# EAGLE design MEMS-preamp_v13b_VBAT (EAGLE 8.5.0)

## Sheet 1 of 2
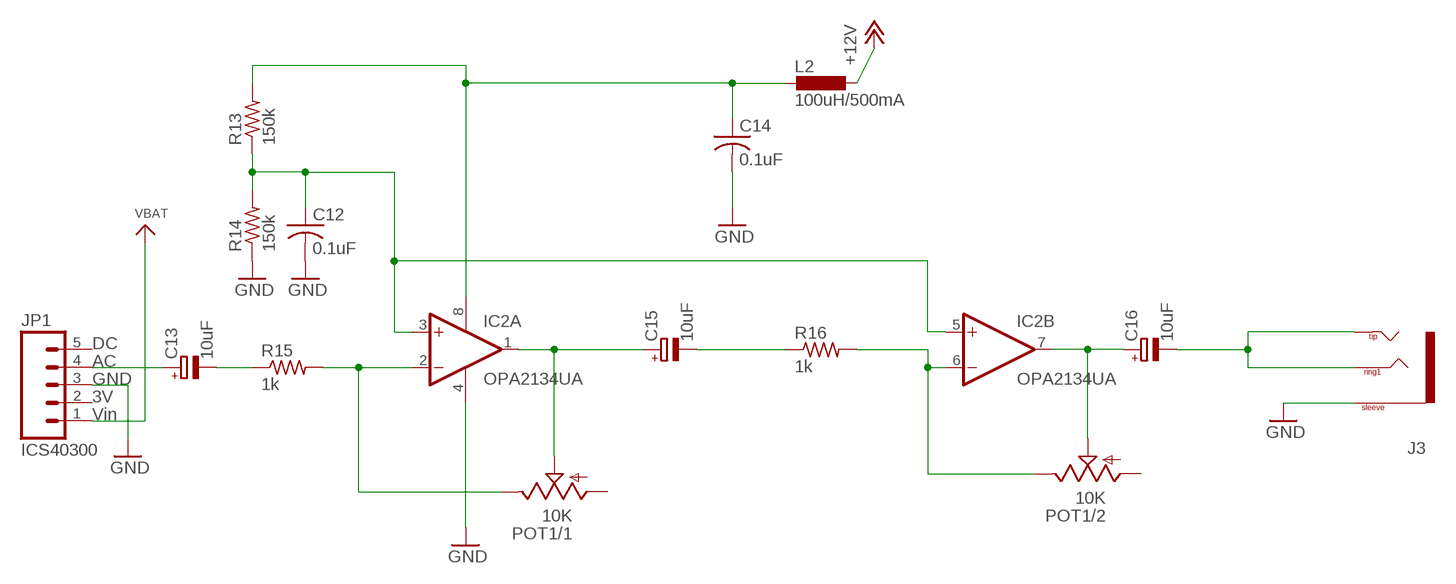
[diagram p0: schematic, sheet 1]

### Parts
C12  0.1uF  C-USC0805  [C0805]
C13  10uF  CPOL-EUB  [PANASONIC_B]
C14  0.1uF  C-USC0805K  [C0805K]
C15  10uF  CPOL-EUB  [PANASONIC_B]
C16  10uF  CPOL-EUB  [PANASONIC_B]
IC2  OPA2134UA  [SO08]
J3  TRS-1/8"-3.5MM  [TRS_SJ-3524-SMT]
JP1  ICS40300  M05SMD_2.54MM  [1X05_SMD_STRAIGHT]
L2  100uH/500mA  L-EUL3225M  [L3225M]
POT1  10K  POT-DUAL-PTV112-4420  [PTV112]
R13  150k  R-US_R0603  [R0603]
R14  150k  R-US_R0603  [R0603]
R15  1k  R-US_R0603  [R0603]
R16  1k  R-US_R0603  [R0603]

### Nets
+12V: L2.1 ; also sheet 2
GND: C12.2 C14.2 IC2.4(A:V-) J3.1(SLEEVE) JP1.3 R14.1 ; also sheet 2
N$3: C13.+ JP1.4
N$4: C15.- R16.1
N$5: IC2.2(A:-IN) POT1.1.3(/1:E) R15.2
N$7: C16.- J3.2(TIP) J3.3(RING1) J3.4(TIP)
N$8: C12.1 IC2.3(A:+IN) IC2.5(B:+IN) R13.1 R14.2
N$9: C15.+ IC2.1(A:OUT) POT1.1.2(/1:S)
N$10: C16.+ IC2.7(B:OUT) POT1.2.2(/2:S)
N$15: C14.1 IC2.8(A:V+) L2.2 R13.2
N$21: IC2.6(B:-IN) POT1.2.3(/2:E) R16.2
N$23: C13.- R15.1
VBAT: JP1.1 ; also sheet 2
Unconnected: JP1.2 JP1.5 POT1.1.1(/1:A) POT1.2.1(/2:A)

## Sheet 2 of 2
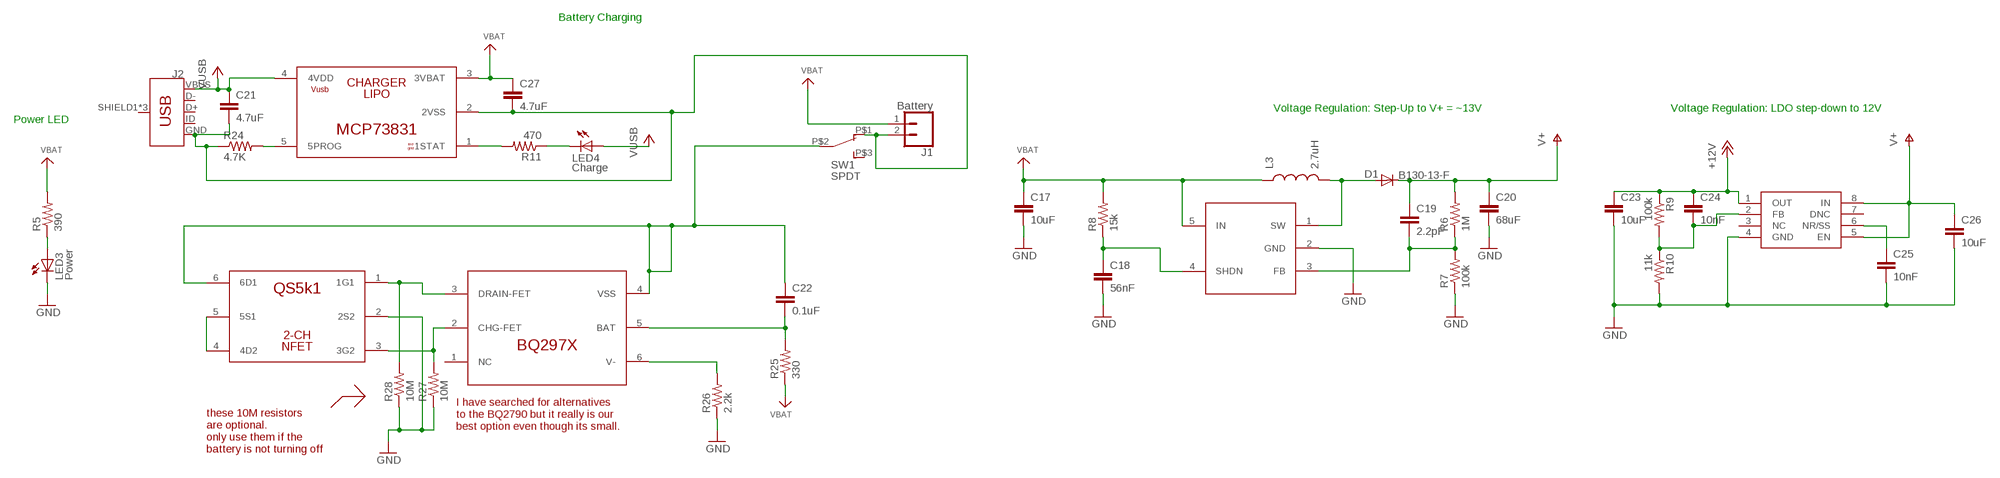
[diagram p1: schematic, sheet 2]

### Parts
C17  10uF  C-EUC0603  [C0603]
C18  56nF  C-EUC0603  [C0603]
C19  2.2pF  C-EUC0603  [C0603]
C20  68uF  C-EUC1206  [C1206]
C21  4.7uF  C-EUC0603  [C0603]
C22  0.1uF  C-EUC0603  [C0603]
C23  10uF  C-EUC0603  [C0603]
C24  10nF  C-EUC0603  [C0603]
C25  10nF  C-EUC0603  [C0603]
C26  10uF  C-EUC0603  [C0603]
C27  4.7uF  C-EUC0603  [C0603]
D1  B130-13-F  DIODESMA  [SMA-DIODE]
IC7  TPS7A49  [MSOP-8]
IC8  BQ297X  BQ297X-BATTERY-MANAGERLONG  [WSON-6-LONG]
IC9  SC4503  [SOT23-5]
IC10  MCP73831  [SOT-23-5]
IC11  QS6K1  [SOT457R_PHILIPS]
J1  Battery  CONN_02LOCK  [1X02_LOCK]
J2  USB_MICRO-BREDUCED_PASTE  [USB-B-MICRO-SMD_RED_PASTE]
L3  2.7uH  INDUCTORCR54  [CR54]
LED3  Power  LED3MM  [LED3MM]
LED4  Charge  LED3MM  [LED3MM]
R5  390  R-US_R0603  [R0603]
R6  1M  R-US_R0603  [R0603]
R7  100k  R-US_R0603  [R0603]
R8  15k  R-US_R0603  [R0603]
R9  100k  R-US_R0603  [R0603]
R10  11k  R-US_R0603  [R0603]
R11  470  R-US_R0603  [R0603]
R24  4.7K  R-US_R0603  [R0603]
R25  330  R-US_R0603  [R0603]
R26  2.2k  R-US_R0603  [R0603]
R27  10M  R-US_R0603  [R0603]
R28  10M  R-US_R0603  [R0603]
SW1  SPDT  SWITCH_SPDTCL-SB-12B  [SWITCH_SPDT_CL-SB-12B]

### Nets
+5V: C21.1 IC10.4(4VDD) J2.VBUS LED4.A ; supply symbol labelled VUSB
+12V: C23.1 C24.1 IC7.1(OUT) R9.1 ; also sheet 1
BATGND1: C22.1 IC8.4(VSS) IC11.6(6D1) SW1.P$2
GND: C17.2 C18.2 C20.2 C23.2 C25.2 C26.2 IC7.4(GND) IC9.2(GND) IC11.2(2S2) LED3.K(C) R7.1 R10.2 R26.1 R27.1 R28.1 ; also sheet 1
N$6: LED3.A R5.1
N$11: D1.A IC9.1(SW) L3.P$2
N$12: C18.1 IC9.4(SHDN) R8.1
N$13: C19.2 IC9.3(FB) R6.1 R7.2
N$14: C24.2 IC7.2(FB) R9.2 R10.1
N$16: C25.1 IC7.6(NR/SS)
N$17: LED4.K(C) R11.1
N$19: C22.2 IC8.5(BAT) R25.2
N$20: IC10.5(5PROG) R24.2
N$24: IC10.1(1STAT) R11.2
N$33: IC11.4(4D2) IC11.5(5S1)
N$35: IC8.3(DRAIN-FET) IC11.1(1G1) R28.2
N$36: IC8.2(CHG-FET) IC11.3(3G2) R27.2
N$37: IC8.6(V-) R26.2
USBGND1: C21.2 C27.2 IC10.2(2VSS) J1.2 J2.GND R24.1 SW1.P$1
V+: C19.1 C20.1 C26.1 D1.C IC7.5(EN) IC7.8(IN) R6.2
VBAT: C17.1 C27.1 IC9.5(IN) IC10.3(3VBAT) J1.1 L3.P$1 R5.2 R8.2 R25.1 ; also sheet 1
Unconnected: IC7.3(NC) IC7.7(DNC) IC8.1(NC) J2.D+ J2.D- J2.ID J2.SHIELD1(SHIELD) J2.SHIELD2(SHIELD) J2.SHIELD3(SHIELD) SW1.P$3

### Notes on the sheet
- Battery Charging
- Voltage Regulation: Step-Up to V+ = ~13V | Voltage Regulation: LDO step-down to 12V
- Power LED
- I have searched for alternatives 
  to the BQ2790 but it really is our 
  best option even though its small.
- these 10M resistors
  are optional. 
  only use them if the 
  battery is not turning off

## Library data of the parts
C12 C14 = adafruit:C-US: CAPACITOR, American symbol
C13 C15 C16 = CMU-ArtFab:CPOL-EU: POLARIZED CAPACITOR, European symbol
C17-C27 = rcl:C-EU: CAPACITOR, European symbol; SPICEPREFIX: C
D1 = SparkFun:DIODE: Diode These are standard reverse protection diodes and small signal diodes. SMA package can handle up to about 1A. SOD-323 can handle about 200mA. What the SOD-323 package when ordering, there are some mfgs out there that are 5-pin packages.
IC2 = linear:OPA2*: Dual Operational Amplifier Low Power, Single-Supply, Rail-To-Rail Operational Amplifier Source: http://focus.ti.com/lit/ds/symlink/opa2345.pdf http://focus.ti.com .. opa241.pdf http://focus.ti.com/lit/ds/symlink/opa2134.pdf
IC7 = CMU-ArtFab:TPS7A49
IC8 = CMU-ArtFab:BQ297X-BATTERY-MANAGER
IC9 = CMU-ArtFab:SC4503
IC10 = CMU-ArtFab:MCP73831
IC11 = CMU-ArtFab:QS6K1
J1 = SparkFun-Connectors:CONN_02: Multi connection point. Often used as Generic Header-pin footprint for 0.1 inch spaced/style header connections On any of the 0.1 inch spaced packages, you can populate with these: Break Away Headers - Straight <https://www.sparkfun.com/products/116> (PRT-00116) Break Away Male Headers - Right Angle <https://www.sparkfun.com/products/553> (PRT-00553) Female Headers <https://www.sparkfun.com/products/115> (PRT-00115) Break Away Headers - Machine Pin <https://www.sparkfun.com/products/117> (PRT-00117) Break Away Female Headers - Swiss Machine Pin <https://www.sparkfun.com/products/743> (PRT-00743) For SCREWTERMINALS and SPRING TERMINALS visit here: Screw Terimnals on SparkFun.com <https://www.sparkfun.com/search/results?term=Screw+Terminals> (5mm/3.5mm/2.54mm spacing) This device is also useful as a general connection point to wire up your design to another part of your project. Our various solder wires solder well into these plated through hole pads. Hook-Up Wire - Assortment (Stranded, 22 AWG) <https://www.sparkfun.com/products/11375> (PRT-11375) Hook-Up Wire - Assortment (Solid Core, 22 AWG) <https://www.sparkfun.com/products/11367> (PRT-11367) View the entire wire category on our website here <https://www.sparkfun.com/categories/141> Special notes: Molex polarized connector foot print use with: PRT-08233 with associated crimp pins and housings. 2.54_SCREWTERM for use with PRT-10571. 3.5mm Screw Terminal footprints for PRT-08084 5mm Screw Terminal footprints for use with PRT-08432
J2 = CMU-ArtFab:USB_MICRO-B: USB Type Micro-B Connector Male/female and PTH/SMT variants SparkFun Products: SparkFun microB USB Breakout <https://www.sparkfun.com/products/12035> SparkFun USB microB Plug Breakout <https://www.sparkfun.com/products/10031> SparkFun ESP8266 Thing <https://www.sparkfun.com/products/13231>; PROD_ID: CONN-11752
J3 = CMU-ArtFab:TRS-1/8"-3.5MM
JP1 = CMU-ArtFab:M05: Multi connection point. Often used as Generic Header-pin footprint for 0.1 inch spaced/style header connections On any of the 0.1 inch spaced packages, you can populate with these: Break Away Headers - Straight <https://www.sparkfun.com/products/116> (PRT-00116) Break Away Male Headers - Right Angle <https://www.sparkfun.com/products/553> (PRT-00553) Female Headers <https://www.sparkfun.com/products/115> (PRT-00115) Break Away Headers - Machine Pin <https://www.sparkfun.com/products/117> (PRT-00117) Break Away Female Headers - Swiss Machine Pin <https://www.sparkfun.com/products/743> (PRT-00743) For SCREWTERMINALS and SPRING TERMINALS visit here: Screw Terimnals on SparkFun.com <https://www.sparkfun.com/search/results?term=Screw+Terminals> (5mm/3.5mm/2.54mm spacing) This device is also useful as a general connection point to wire up your design to another part of your project. Our various solder wires solder well into these plated through hole pads. Hook-Up Wire - Assortment (Stranded, 22 AWG) <https://www.sparkfun.com/products/11375> (PRT-11375) Hook-Up Wire - Assortment (Solid Core, 22 AWG) <https://www.sparkfun.com/products/11367> (PRT-11367) View the entire wire category on our website here <https://www.sparkfun.com/categories/141> Special notes: Molex polarized connector foot print use with SKU : PRT-08231 with associated crimp pins and housings. 1MM SMD Version SKU: PRT-10208; CON1: Vin; CON2: 3V; CON3: GND; CON4: AC; CON5: DC
L2 = rcl:L-EU: INDUCTOR, European symbol; SPICEPREFIX: L
L3 = SparkFun-Passives:INDUCTOR: Inductors Basic Inductor/Choke - 0603 and 1206. Footprints are not proven and vary greatly between part numbers. SRN6045- 33uH, 20% 1.4A SDR0403-560KL - 56uH, 10%, 500mA RMS/740mA peak
LED3 LED4 = led:LED: LED OSRAM: - CHIPLED LG R971, LG N971, LY N971, LG Q971, LY Q971, LO R971, LY R971 LH N974, LH R974 LS Q976, LO Q976, LY Q976 LO Q996 - Hyper CHIPLED LW Q18S LB Q993, LB Q99A, LB R99A - SideLED LS A670, LO A670, LY A670, LG A670, LP A670 LB A673, LV A673, LT A673, LW A673 LH A674 LY A675 LS A676, LA A676, LO A676, LY A676, LW A676 LS A679, LY A679, LG A679 - Hyper Micro SIDELED® LS Y876, LA Y876, LO Y876, LY Y876 LT Y87S - SmartLED LW L88C, LW L88S LB L89C, LB L89S, LG L890 LS L89K, LO L89K, LY L89K LS L896, LA L896, LO L896, LY L896 - TOPLED LS T670, LO T670, LY T670, LG T670, LP T670 LSG T670, LSP T670, LSY T670, LOP T670, LYG T670 LG T671, LOG T671, LSG T671 LB T673, LV T673, LT T673, LW T673 LH T674 LS T676, LA T676, LO T676, LY T676, LB T676, LH T676, LSB T676, LW T676 LB T67C, LV T67C, LT T67C, LS T67K, LO T67K, LY T67K, LW E67C LS E67B, LA E67B, LO E67B, LY E67B, LB E67C, LV E67C, LT E67C LW T67C LS T679, LY T679, LG T679 LS T770, LO T770, LY T770, LG T770, LP T770 LB T773, LV T773, LT T773, LW T773 LH T774 LS E675, LA E675, LY E675, LS T675 LS T776, LA T776, LO T776, LY T776, LB T776 LHGB T686 LT T68C, LB T68C - Hyper Mini TOPLED® LB M676 - Mini TOPLED Santana® LG M470 LS M47K, LO M47K, LY M47K Source: http://www.osram.convergy.de LUXEON: - LUMILED® LXK2-PW12-R00, LXK2-PW12-S00, LXK2-PW14-U00, LXK2-PW14-V00 LXK2-PM12-R00, LXK2-PM12-S00, LXK2-PM14-U00 LXK2-PE12-Q00, LXK2-PE12-R00, LXK2-PE12-S00, LXK2-PE14-T00, LXK2-PE14-U00 LXK2-PB12-K00, LXK2-PB12-L00, LXK2-PB12-M00, LXK2-PB14-N00, LXK2-PB14-P00, LXK2-PB14-Q00 LXK2-PR12-L00, LXK2-PR12-M00, LXK2-PR14-Q00, LXK2-PR14-R00 LXK2-PD12-Q00, LXK2-PD12-R00, LXK2-PD12-S00 LXK2-PH12-R00, LXK2-PH12-S00 LXK2-PL12-P00, LXK2-PL12-Q00, LXK2-PL12-R00 Source: www.luxeon.com KINGBRIGHT: KA-3528ASYC Source: www.kingbright.com
POT1 = CMU-ArtFab:POT-DUAL-PTV112: Bourns 11mm dual potentiometer; AVAILABILITY: Unavailable; DESCRIPTION: Alt# Tce-10111410; MF: STMicroelectronics; MP: PTV112; PACKAGE: None; PRICE: None
R5-R11 R13-R16 R24-R28 = CMU-ArtFab:R-US_: RESISTOR, American symbol
SW1 = CMU-ArtFab:SWITCH_SPDT

## Board
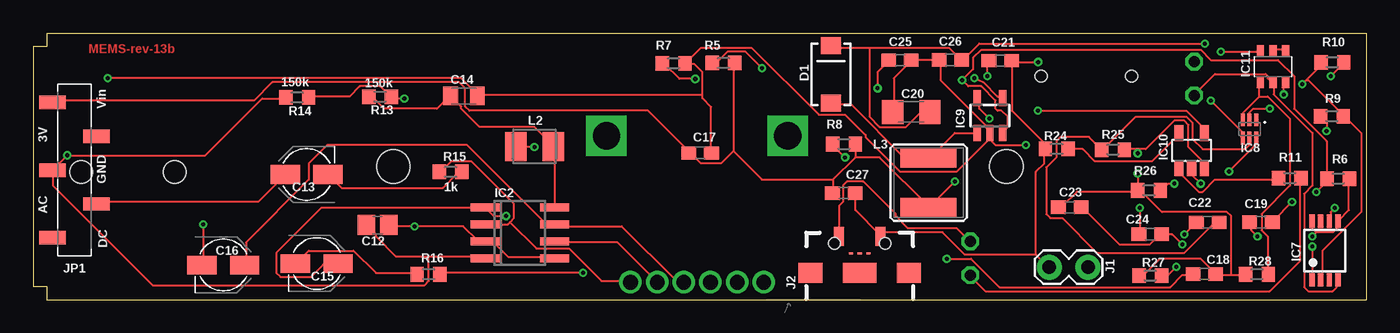
[diagram p2: board, top side]
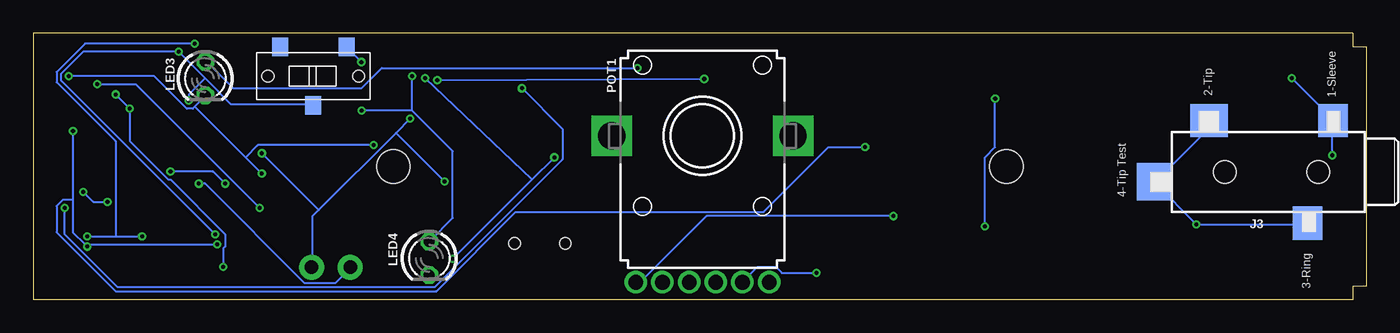
[diagram p3: board, bottom side, seen from below]

Size 100 x 20 mm. Coordinates in mm from the lower left corner, seen from the top.
Outline: 0,19 0,1 1.02,1 1,0 100,0 100,20 1,20 1,19 0,19
Copper layers (1*16): Top 0.035mm / dielectric 1.5mm / Bottom 0.035mm
Design rules "SeeedStudio_2layer_DRU_no_angle_20140221": minimum track width 6mil, minimum drill 12mil, track to track 6mil, track to pad 6mil, pad to pad 6mil, via to via 6mil, smd to smd 0mil, copper to edge 10mil, drill to drill 10mil, minimum pad ring 10mil, minimum via ring 6mil, stop-mask expansion 2mil, vias tented up to drill 100mil, thermal gap 10mil
Holes 2.5 mm at 73,10 27,10

### Footprints (pad centres in the part's own frame; a part is rotated, then mirrored left to right if it is on the bottom)
C0805 = smd 1.3 x 1.5: 1 -0.85,0; 2 0.85,0
PANASONIC_B = smd 2.2 x 1.4: + 1.6,0; - -1.6,0
C0805K = smd 1.1 x 1.4: 1 -1,0; 2 1,0
C0603 = smd 1.1 x 1: 1 -0.85,0; 2 0.85,0
C1206 = smd 1.6 x 1.8: 1 -1.4,0; 2 1.4,0
SMA-DIODE = smd 1.27 x 1.47: A -2.15,0; C 2.15,0
SO08 = smd 0.6 x 2.2: 1 -1.905,-2.6; 2 -0.635,-2.6; 3 0.635,-2.6; 4 1.905,-2.6; 5 1.905,2.6; 6 0.635,2.6; 7 -0.635,2.6; 8 -1.905,2.6
MSOP-8 = smd 0.4 x 1: 1 -0.975,-2.2; 2 -0.325,-2.2; 3 0.325,-2.2; 4 0.975,-2.2; 5 0.975,2.2; 6 0.325,2.2; 7 -0.325,2.2; 8 -0.975,2.2
WSON-6-LONG = smd 0.3 x 0.954: 1 -0.5,-0.686; 2 0,-0.686; 3 0.5,-0.686; 4 0.5,0.686; 5 0,0.686; 6 -0.5,0.686
SOT23-5 = smd 0.55 x 1.2: 1 -0.95,-1.3; 2 0,-1.3; 3 0.95,-1.3; 4 0.95,1.3; 5 -0.95,1.3
SOT-23-5 = smd 0.69 x 1.2: 1 -0.95,-1.3; 2 0,-1.3; 3 0.95,-1.3; 4 0.95,1.3; 5 -0.95,1.3
SOT457R_PHILIPS = smd 0.55 x 0.8: 1 -0.95,-1.2; 2 0,-1.2; 3 0.95,-1.2; 4 0.95,1.2; 5 0,1.2; 6 -0.95,1.2
1X02_LOCK = drill 1.016 pad 1.88: 1 -0.178,0; 2 2.718,0
USB-B-MICRO-SMD_RED_PASTE = smd 0.152 x 0.305: D+ 1.455,0; D- 1.455,0.65; ID 1.455,-0.65 | smd 1.45 x 0.762: GND 2.725,-1.554 | smd 1.5 x 1.8: SHIELD1 0,3.685; SHIELD2 0,-3.685 | smd 1.5 x 2.5: SHIELD3 0,0 | smd 1.45 x 0.781: VBUS 2.725,1.554 | hole 0.85: 2.2,1.9; 2.2,-1.9
TRS_SJ-3524-SMT = smd 2.5 x 2.2: 1 3.85,-4.6; 3 -3.85,-2.7 | smd 2.5 x 2.8: 2 3.85,4.7 | smd 2.8 x 2.5: 4 -0.75,8.85 | hole 1.7: 0,-3.5; 0,3.5
1X05_SMD_STRAIGHT = smd 1 x 2: 1 0,1.65; 2 -2.54,-1.65; 3 -5.08,1.65; 4 -7.62,-1.65; 5 -10.16,1.65
L3225M = smd 1.6 x 2.2: 1 -1.4,0; 2 1.4,0
CR54 = smd 4.2 x 1.4: P$1 0,1.85; P$2 0,-1.85
LED3MM = drill 0.813 octagon: A -1.27,0; K 1.27,0
PTV112 = drill 1.1 pad 1.676: 1.1 -3,-11; 1.2 -5,-11; 1.3 5,-11; 2.1 -1,-11; 2.2 1,-11; 2.3 3,-11 | drill 2.032 pad 2.8 square: M1 -6.8,0; M2 6.8,0
R0603 = smd 1 x 1.1: 1 -0.85,0; 2 0.85,0
SWITCH_SPDT_CL-SB-12B = smd 1.2 x 1.4: P$1 -2.5,-2.2; P$2 0,2.2; P$3 2.5,-2.2 | hole 0.9: -3.4,0; 3.4,0

### Placement (x,y rotation side)
C12  25.83,5.6 180 top
C13  20.5,9.4 180 top
C14  32.3,15.3 0 top
C15  21.27,2.71 0 top
C16  14.26,2.6 0 top
C17  50.03,11.01 0 top
C18  87.86,1.92 0 top
C19  92.11,5.81 0 top
C20  65.87,14.1 180 top
C21  72.54,17.94 0 top
C22  88.1,5.8 0 top
C23  77.75,6.93 180 top
C24  83.79,4.92 180 top
C25  65.02,17.98 0 top
C26  68.8,18 180 top
C27  60.8,8 0 top
D1  59.84,16.91 90 top
IC2  36.5,5 270 top
IC7  96.91,3.68 0 top
IC8  91.25,12.81 180 top
IC9  71.77,13.82 0 top
IC10  86.9,11.2 0 top
IC11  93,17.5 0 top
J1  78.95,2.44 180 top
J2  62,2.02 90 top
J3  7.1,9.6 90 bottom
JP1  3.09,14.8 90 top
L2  37.6,11.5 0 top
L3  67.17,8.79 180 top
LED3  87.1,16.6 270 bottom
LED4  70.3,3.1 270 bottom
POT1  49.8,12.3 0 bottom
R5  51.78,17.77 0 top
R6  97.91,9.09 0 top
R7  48.05,17.74 180 top
R8  60.83,11.68 0 top
R9  97.44,13.77 0 top
R10  97.47,17.82 0 top
R11  94.26,9.12 180 top
R13  26.01,15.24 180 top
R14  19.81,15.19 0 top
R15  31.3,9.59 180 top
R16  29.64,1.89 0 top
R24  76.78,11.32 0 top
R25  81.01,11.26 180 top
R26  83.7,8.2 0 top
R27  83.8,1.8 0 top
R28  91.8,1.9 0 top
SW1  79,16.78 180 bottom

### Tracks (layer width: path | path; a pad name or v marks a point on that pad's centre or on a via)
+5V  (via drill 0.3)
  Top 0.152: v71.58,16.78 71.58,17.85 C21.1 | v75.37,14.19 86.51,14.19 87.73,12.97 87.73,12.51 IC10.4 | J2.VBUS 60.45,4.89 60.45,7.03 60.76,7.33 60.76,8.55 61.06,8.86 62.28,8.86 64.72,6.42 64.72,6.27 65.63,5.35 69.29,5.35 70.21,4.44 LED4.A
  Bottom 0.152: 71.58,14.19 v71.58,16.78 | 71.58,14.19 68.53,11.14 68.53,6.11 70.21,4.44 LED4.A | 71.58,14.19 v75.37,14.19
+12V  (via drill 0.3)
  Top 0.152: C23.1 78.74,6.88 81.48,4.13 83.77,4.13 84.53,4.89 C24.1 84.68,4.89 85.45,4.89 v86.21,4.13 | v95.96,3.98 95.96,1.54 IC7.1 | v97.03,12.67 97.03,13.43 96.72,13.73 R9.1 | v37.59,11.45 36.22,11.45 L2.1
  Bottom 0.152: 96.11,4.13 97.03,5.05 97.03,7.48 | v97.03,12.67 97.03,7.48 | v37.59,11.45 40.33,11.45 45.21,6.57 63.8,6.57 69.75,0.63 93.83,0.63 98.25,5.05 98.25,7.03 97.79,7.48 97.03,7.48 | 96.11,4.13 v86.21,4.13 | 96.11,4.13 v95.96,3.98
BATGND1  (via drill 0.3)
  Top 0.152: v89.1,18.61 92,18.61 IC11.6 | v88.34,14.95 90.63,12.67 90.63,12.21 IC8.4 | v86.36,4.89 87.12,5.66 C22.1
  Bottom 0.152: 87.12,16.63 85.14,14.65 79.04,14.65 SW1.P$2 | 87.12,16.63 v89.1,18.61 96.27,18.61 97.94,16.93 97.94,16.48 v86.36,4.89 | v88.34,14.95 88.34,15.41 87.12,16.63
GND  (via drill 0.3)
  Top 0.152: 29.67,3.22 33.78,3.22 IC2.4 | 29.67,3.22 27.23,3.22 25.7,4.74 25.7,4.89 25.09,5.5 C12.2 | R14.1 18.85,15.1 17.17,15.1 12.9,10.84 v2.54,10.84 1.47,9.77 JP1.3 1.47,9.62 1.47,8.55 8.94,1.08 29.36,1.08 29.67,1.39 29.67,3.22 | C23.2 76.91,7.03 77.22,7.03 78.28,8.09 82.7,8.09 R26.1 | R27.1 83.01,1.85 83.31,1.85 84.53,3.06 87.58,3.06 88.65,2 C18.2 88.8,1.85 89.86,1.85 | 89.86,1.85 90.93,1.85 R28.1 | 89.86,1.85 89.86,6.27 89.56,6.57 84.68,6.57 83.16,8.09 82.85,8.09 R26.1 | LED3.K 87.12,15.41 88.65,16.93 92.46,16.93 92.61,16.78 92.61,16.63 92.91,16.32 IC11.2 93.06,16.17 93.06,15.41 95.96,12.51 95.96,8.55 95.35,7.94 95.35,0.93 95.66,0.63 97.48,0.63 97.79,0.93 97.79,1.39 IC7.4 | v97.33,16.78 98.25,17.7 R10.2 | v82.85,9.47 82.85,8.25 R26.1 | IC9.2 71.73,12.67 71.42,12.97 71.42,13.12 68.07,16.48 68.07,18 C26.2 65.94,18 C25.2 65.79,17.85 64.57,16.63 64.57,14.19 C20.2 | C17.2 50.85,11.14 50.85,14.47 50.2,15.12 50.2,15.4 | 71.73,12.06 71.73,12.51 IC9.2 | 71.73,12.06 69.29,9.62 65.02,9.62 62.43,12.21 62.43,12.36 60.91,13.88 58.93,13.88 53.9,18.91 50.09,18.91 49.02,17.85 R7.1 49.02,17.7 49.61,17.7 50.2,17.1 50.2,15.4 | v74.47,11.6 72.19,11.6 71.73,12.06 | 71.73,12.06 IC9.2 | v5.59,16.63 32.11,16.63 33.32,15.41 | 33.32,15.41 C14.2 | 50.2,15.4 50.19,15.41 33.32,15.41
  Bottom 0.152: v2.54,10.84 2.54,13.43 J3.1 2.54,13.58 v5.59,16.63 | v97.33,16.78 90.93,16.78 88.49,14.34 88.04,14.34 87.88,14.5 | 87.88,14.5 87.12,15.26 LED3.K | 87.88,14.5 84.07,10.68 | 84.07,10.68 v82.85,9.47 | 84.07,10.68 83.16,11.6 v74.47,11.6
N$3
  Top 0.152: JP1.4 4.83,7.33 16.87,7.33 18.85,9.31 C13.+
N$4
  Top 0.152: R16.1 28.75,2 25.7,2 24.03,3.67 20.68,3.67 19.76,2.76 C15.-
N$5
  Top 0.152: 35.76,5.81 35.61,5.66 33.93,5.66 IC2.2 | 35.76,5.81 36.07,6.11 36.07,7.18 32.87,10.38 31.34,10.38 30.58,9.62 R15.2 | 35.76,5.81 37.74,3.83 40.18,3.83 42.62,1.39 44.75,1.39 POT1.1.3
N$6  (via drill 0.3)
  Top 0.152: v54.66,17.39 53.44,18.61 52.07,18.61 51.31,17.85 51,17.85 R5.1
  Bottom 0.152: v54.66,17.39 73.86,17.39 75.39,15.87 84.99,15.87 86.97,17.85 LED3.A
N$7  (via drill 0.3)
  Top 0.152: v12.75,5.66 12.75,2.61 C16.-
  Bottom 0.152: J3.3 4.52,5.66 v12.75,5.66 15.8,8.7 J3.4 15.8,8.86 11.84,12.82 11.84,13.43 J3.2
N$8  (via drill 0.3)
  Top 0.152: R14.2 20.68,15.26 23.72,15.26 24.49,16.02 26.01,16.02 26.77,15.26 R13.1 26.92,15.1 v27.84,15.1 | C12.1 26.77,5.5 v28.6,5.5 32.26,5.5 33.32,4.44 33.78,4.44 IC2.3 33.93,4.28 34.54,4.28 35.61,3.22 38.96,3.22 IC2.5
  Bottom 0.152: v27.84,15.1 27.84,11.45 28.6,10.68 v28.6,5.5
N$9  (via drill 0.3)
  Top 0.152: C15.+ 22.81,2.61 21.74,2.61 20.83,1.69 18.54,1.69 18.24,2 18.24,3.52 21.59,6.88 33.78,6.88 IC2.1 33.93,6.88 34.54,6.27 v35.46,6.27
  Bottom 0.152: v35.46,6.27 49.48,6.27 54.36,1.39 54.66,1.39 POT1.1.2
N$10
  Top 0.152: C16.+ 15.95,2.61 15.95,4.28 20.68,9.01 20.68,10.23 22.05,11.6 32.56,11.6 38.51,5.66 38.96,5.66 IC2.7 39.12,5.5 44.14,5.5 48.26,1.39 48.72,1.39 POT1.2.2
N$11
  Top 0.152: IC9.1 69.14,12.51 67.31,10.68 L3.P$2 67.16,10.68 65.33,10.68 61.37,14.65 59.84,14.65 D1.A
N$12  (via drill 0.3)
  Top 0.152: v68.53,3.06 70.36,3.06 72.49,0.93 85.29,0.93 86.21,1.85 86.97,1.85 C18.1 | v60.91,10.68 59.99,11.6 R8.1 | v70.6,16.62 71.27,16.32 72.34,15.26 72.64,15.26 IC9.4
  Bottom 0.152: v60.91,10.68 62.59,9.01 | 62.59,9.01 v68.53,3.06 | 62.59,9.01 v70.6,16.62
N$13  (via drill 0.3)
  Top 0.152: v94.44,7.33 93.06,5.96 C19.2 | v96.27,8.09 97.18,9.01 R6.1 97.03,9.16 97.03,11.9 94.59,14.34 94.59,16.78 93.37,18 88.34,18 87.58,18.76 71.12,18.76 70.51,18.15 70.51,17.3 v69.69,16.48 70.14,16.02 71.12,16.02 72.19,14.95 72.19,14.34 72.34,14.19 72.64,14.19 73.1,13.73 73.1,12.97 72.8,12.67 IC9.3 | R7.2 47.35,17.7 48.46,16.58 v49.66,16.58
  Bottom 0.152: v94.44,7.33 95.5,7.33 v96.27,8.09 | v69.69,16.48 v49.66,16.58
N$14  (via drill 0.3)
  Top 0.152: IC7.2 96.72,1.54 96.72,3.67 99.62,6.57 99.62,12.51 98.4,13.73 R9.2 98.25,13.88 95.66,16.48 95.5,16.48 | v83.01,6.88 83.01,5.05 C24.2 | 95.5,16.48 96.72,17.7 R10.1 | 95.5,16.48 v95.2,16.17
  Bottom 0.152: v83.01,6.88 92.3,16.17 v95.2,16.17
N$15
  Top 0.152: R13.2 25.25,15.1 25.55,15.1 26.31,14.34 30.28,14.34 31.19,15.26 C14.1 31.34,15.26 32.11,14.5 32.11,14.34 33.48,12.97 37.59,12.97 38.96,11.6 L2.2 39.12,11.45 39.12,7.03 IC2.8
N$16  (via drill 0.3)
  Top 0.152: v97.64,6.88 97.33,6.57 97.33,5.96 IC7.6 | v63.35,15.87 63.35,17.09 64.11,17.85 C25.1
  Bottom 0.152: v97.64,6.88 97.64,4.89 93.67,0.93 69.9,0.93 60.3,10.53 60.3,12.82 v63.35,15.87
N$17
  Top 0.152: R11.1 95.05,9.01 95.05,2.91 92.76,0.63 71.42,0.63 70.36,1.69 LED4.K
N$19
  Top 0.152: IC8.5 91.24,12.06 91.24,11.6 90.93,11.29 87.73,11.29 86.97,12.06 86.97,13.28 86.51,13.73 82.7,13.73 80.26,11.29 R25.2 80.11,11.29 79.2,12.21 77.06,12.21 76.76,11.9 76.76,10.68 76,9.92 76,6.42 76.3,6.11 77.22,6.11 79.81,3.52 86.36,3.52 88.49,5.66 88.95,5.66 C22.2
N$20
  Top 0.152: R24.2 77.67,11.29 78.74,11.29 79.65,10.38 83.92,10.38 85.9,12.36 IC10.5
N$21  (via drill 0.3)
  Top 0.152: v41.25,2 30.58,2 R16.2 | IC2.6 39.12,4.28 43.84,4.28 46.74,1.39 POT1.2.3
  Bottom 0.152: v41.25,2 43.84,2 44.3,2.46 45.67,2.46 46.74,1.39 POT1.2.3
N$23
  Top 0.152: R15.1 32.11,9.47 31.8,9.47 30.73,8.4 23.11,8.4 22.2,9.31 C13.-
N$24
  Top 0.152: R11.2 93.37,9.01 88.65,9.01 87.73,8.09 87.43,8.09 86.05,9.47 86.05,9.77 IC10.1
N$33
  Top 0.152: IC11.5 93.06,18.76 93.83,18.76 IC11.4
N$35
  Top 0.152: 92,15.26 92,16.17 IC11.1 | 92,15.26 90.78,14.04 90.78,13.58 IC8.3 | 92,15.26 92.61,15.26 94.28,13.58 94.28,8.55 92.15,6.42 92.15,5.2 92.61,4.74 92.61,2 R28.2
N$36  (via drill 0.3)
  Top 0.152: v93.83,15.41 93.83,16.17 IC11.3 | v92.76,14.34 91.54,14.34 91.24,14.04 91.24,13.58 IC8.2 | v85.75,2.46 85.14,1.85 84.68,1.85 R27.2
  Bottom 0.152: v93.83,15.41 v92.76,14.34 92.76,11.9 89.86,9.01 89.71,9.01 85.6,4.89 85.6,3.98 85.75,3.83 v85.75,2.46
N$37  (via drill 0.3)
  Top 0.152: v89.71,9.62 91.69,11.6 91.69,12.06 IC8.6 | v85.6,8.7 85.14,8.7 84.68,8.25 R26.2
  Bottom 0.152: v89.71,9.62 86.51,9.62 v85.6,8.7
USBGND1  (via drill 0.3)
  Top 0.152: 73.41,17.85 73.41,14.19 75.84,11.75 75.84,11.45 R24.1 75.84,11.29 75.84,10.23 75.23,9.62 75.23,3.37 | 73.41,17.85 v75.39,17.85 | 73.41,17.85 C21.2 | 63.5,4.89 61.67,6.72 61.67,7.94 C27.2 | v87.58,8.7 86.97,9.31 86.97,9.77 IC10.2 | 63.5,4.89 63.65,5.05 68.22,5.05 69.9,3.37 75.23,3.37 | 75.23,3.37 76.15,2.46 J1.2 | 63.5,4.89 J2.GND
  Bottom 0.152: v75.39,17.85 76.45,18.91 SW1.P$1 | v87.58,8.7 87.12,8.7 79.65,1.24 77.37,1.24 76.3,2.3 J1.2
V+  (via drill 0.3)
  Top 0.152: 96.27,5.05 95.96,5.35 95.96,5.81 IC7.8 | 96.27,5.05 97.48,5.05 97.79,5.35 97.79,5.81 IC7.5 97.94,5.96 98.7,6.72 98.7,9.01 R6.2 | v91.85,4.74 91.39,5.2 91.39,5.81 C19.1 | 96.27,5.05 v95.96,4.74 | 62.74,18.91 59.84,18.91 D1.C | 62.74,18.91 68.68,18.91 69.59,18 C26.1 69.75,18 70.97,19.22 v87.88,19.22 | 62.74,18.91 62.74,13.73 63.5,12.97 65.48,12.97 66.55,14.04 67.16,14.04 C20.1
  Bottom 0.152: v95.96,4.74 93.83,4.74 | 93.83,4.74 v91.85,4.74 | 93.83,4.74 93.83,11.9 98.25,16.32 98.25,17.09 96.11,19.22 v87.88,19.22
VBAT  (via drill 0.3)
  Top 0.152: 82.85,11.29 83.46,11.29 85.6,13.43 86.36,13.43 86.66,13.12 86.66,11.45 87.73,10.38 87.73,9.92 IC10.3 | 82.85,11.29 81.94,11.29 R25.1 | v71.73,13.58 70.97,14.34 70.97,15.1 IC9.5 | v82.85,10.99 82.85,11.29 | 59.99,9.01 59.99,8.09 C27.1 | 61.67,10.68 59.99,9.01 | 61.67,10.68 61.67,11.6 R8.2 | 61.67,10.68 63.5,10.68 67.16,7.03 L3.P$1 67.31,7.03 v69.14,8.86 | 52.53,11.14 51.61,10.23 50.09,10.23 49.33,10.99 C17.1 49.17,11.14 46.13,14.19 32.71,14.19 32.41,14.5 32.41,15.87 31.95,16.32 17.93,16.32 16.56,14.95 1.47,14.95 JP1.1 | 52.53,11.14 52.53,17.7 R5.2 | 59.99,9.01 54.66,9.01 52.53,11.14
  Bottom 0.152: 78.59,6.72 79.04,6.27 79.04,2.46 J1.1 | 78.59,6.72 72.8,12.51 | 72.8,12.51 v71.73,13.58 | 78.59,6.72 v82.85,10.99 | v69.14,8.86 72.8,12.51

### Text on the board
Top: MEMS-rev-13b